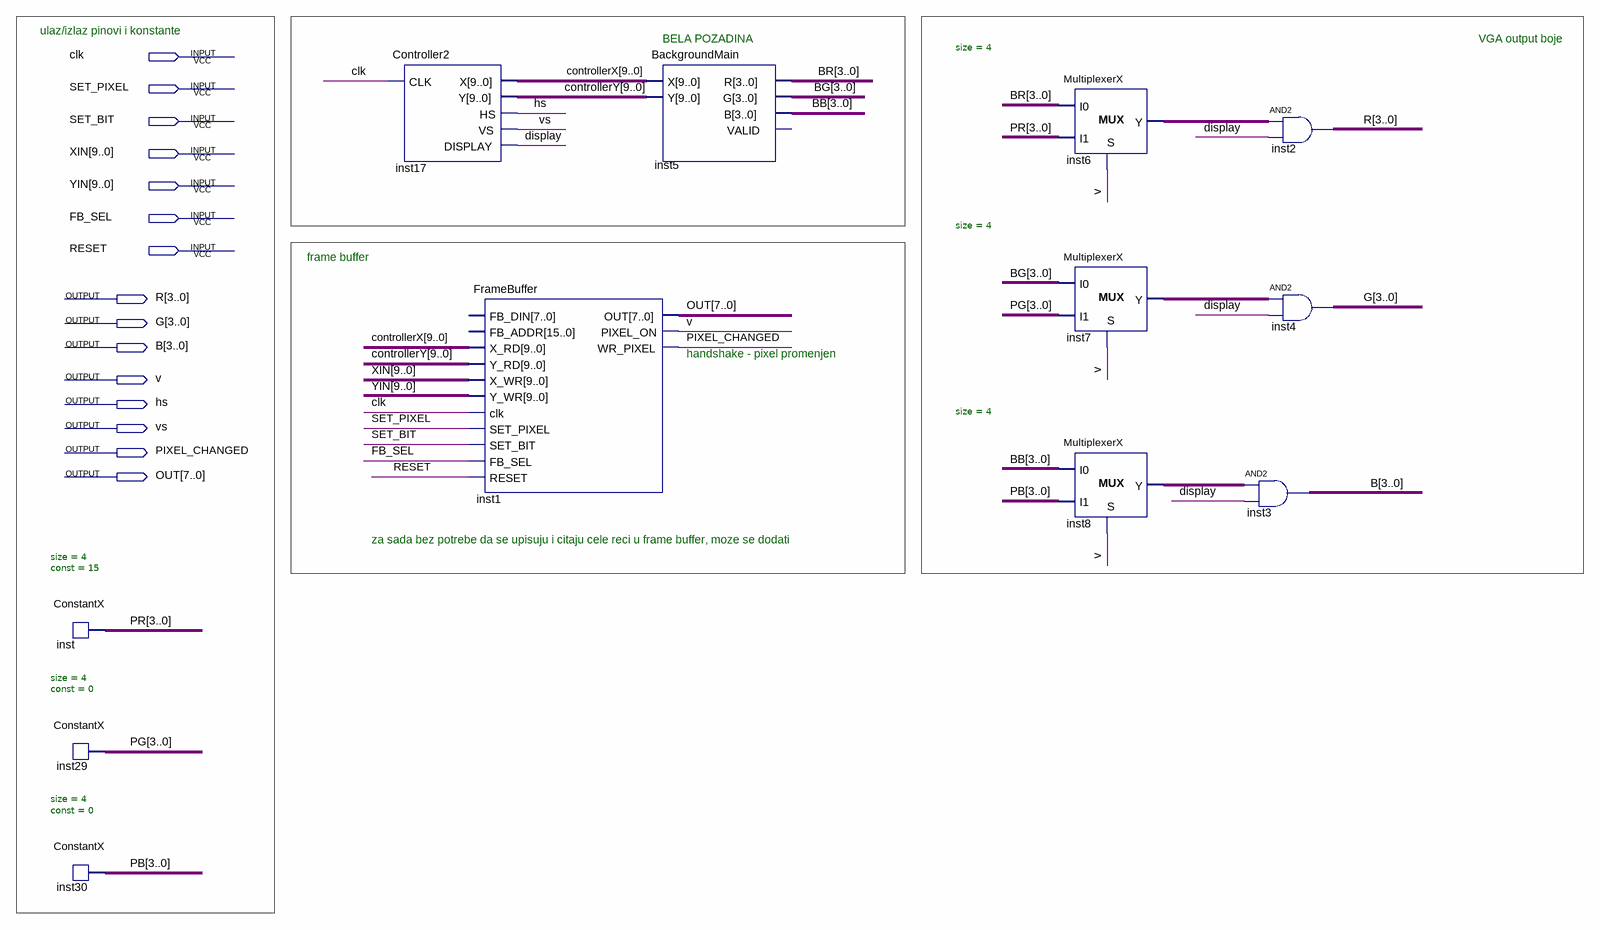
[diagram p0: schematic sheet]
// Quartus schematic Monitor.bdf as structural Verilog: 12 symbols, 15 pins
module Monitor (
  input  clk,
  input  SET_PIXEL,
  input  SET_BIT,
  input  [9:0] XIN,
  input  [9:0] YIN,
  input  FB_SEL,
  input  RESET,
  output [3:0] R,
  output [3:0] G,
  output [3:0] B,
  output v,
  output hs,
  output vs,
  output PIXEL_CHANGED,
  output [7:0] OUT
);

  wire display;
  wire [3:0] BB, BG, BR, inst6_y, inst7_y, inst8_y, PB, PG, PR;
  wire [9:0] controllerX, controllerY;

  ConstantX #(.size(4), .\const (15)) inst (.DATA_OUT(PR));
  ConstantX #(.size(4), .\const (0)) inst29 (.DATA_OUT(PG));
  ConstantX #(.size(4), .\const (0)) inst30 (.DATA_OUT(PB));
  Controller2 inst17 (.CLK(clk), .X(controllerX), .Y(controllerY), .HS(hs), .VS(vs), .DISPLAY(display));
  FrameBuffer inst1 (
    .X_RD(controllerX), .Y_RD(controllerY), .X_WR(XIN), .Y_WR(YIN), .clk(clk), .SET_PIXEL(SET_PIXEL),
    .SET_BIT(SET_BIT), .FB_SEL(FB_SEL), .RESET(RESET), .OUT(OUT), .PIXEL_ON(v), .WR_PIXEL(PIXEL_CHANGED));  // open: FB_DIN, FB_ADDR
  BackgroundMain inst5 (.X(controllerX), .Y(controllerY), .R(BR), .G(BG), .B(BB));  // open: VALID
  MultiplexerX #(.size(4)) inst6 (.S(v), .I0(BR), .I1(PR), .Y(inst6_y));
  MultiplexerX #(.size(4)) inst7 (.S(v), .I0(BG), .I1(PG), .Y(inst7_y));
  MultiplexerX #(.size(4)) inst8 (.S(v), .I0(BB), .I1(PB), .Y(inst8_y));
  assign R = inst6_y & {4{display}};  // AND2 inst2, 4 bits wide
  assign G = inst7_y & {4{display}};  // AND2 inst4, 4 bits wide
  assign B = inst8_y & {4{display}};  // AND2 inst3, 4 bits wide

  // Notes on the sheet:
  //   ulaz/izlaz pinovi i konstante
  //   BELA POZADINA
  //   VGA output boje
  //   frame buffer
  //   handshake - pixel promenjen
  //   za sada bez potrebe da se upisuju i citaju cele reci u frame buffer, moze se dodati
endmodule
